# EAGLE schematic piezo-preamp-tickler_V2-RevG-Breakout (EAGLE 8.5.0)

## Sheet 1 of 2
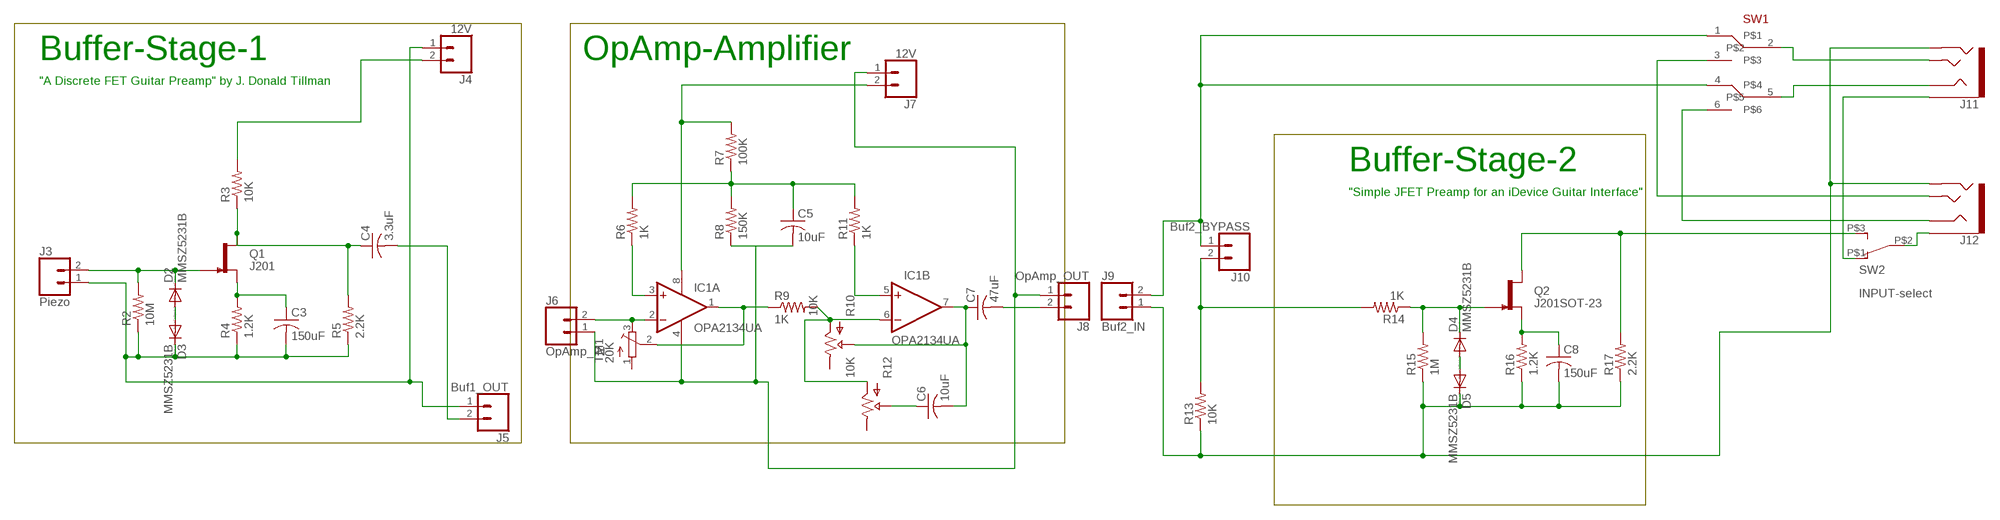
[diagram p0: schematic, sheet 1]

### Parts
C3  150uF  C-US  [CT7343]
C4  3.3uF  C-US  [CT7343]
C5  10uF  C-USC0805K  [C0805K]
C6  10uF  C-USC0805K  [C0805K]
C7  47uF  C-US  [CT7343]
C8  150uF  C-US  [CT7343]
D2  MMSZ5231B  DIODE-SOD123  [SOD123]
D3  MMSZ5231B  DIODE-SOD123  [SOD123]
D4  MMSZ5231B  DIODE-SOD123  [SOD123]
D5  MMSZ5231B  DIODE-SOD123  [SOD123]
IC1  OPA2134UA  [SO08]
J3  Piezo  CONN_02  [1X02]
J4  12V  CONN_02  [1X02]
J5  Buf1_OUT  CONN_02  [1X02]
J6  OpAmp_IN  CONN_02  [1X02]
J7  12V  CONN_02  [1X02]
J8  OpAmp_OUT  CONN_02  [1X02]
J9  Buf2_IN  CONN_02  [1X02]
J10  Buf2_BYPASS  CONN_02  [1X02]
J11  AUDIO-JACK3LGPADS  [AUDIO-JACK-TRRS-SMD]
J12  AUDIO-JACK3LGPADS  [AUDIO-JACK-TRRS-SMD]
Q1  J201  J201SOT-23  [SOT23-3]
Q2  J201SOT-23  [SOT23-3]
R2  10M  R-US_R0805  [R0805]
R3  10K  R-US_R0805  [R0805]
R4  1.2K  R-US_R0805  [R0805]
R5  2.2K  R-US_R0805  [R0805]
R6  1K  R-US_R0805  [R0805]
R7  100K  R-US_R0805  [R0805]
R8  150K  R-US_R0805  [R0805]
R9  1K  R-US_R0805  [R0805]
R10  10K  POTTHUMBPOT14  [THUMBPOT14]
R11  1K  R-US_R0805  [R0805]
R12  10K  POTTHUMBPOT14  [THUMBPOT14]
R13  10K  R-US_R0805  [R0805]
R14  1K  R-US_R0805  [R0805]
R15  1M  R-US_R0805  [R0805]
R16  1.2K  R-US_R0805  [R0805]
R17  2.2K  R-US_R0805  [R0805]
SW1  SWITCH_DPDT  [SWITCH_DPDT_CL-SB-22B]
SW2  INPUT-select  SWITCH_SPDTCL-SB-12B  [SWITCH_SPDT_CL-SB-12B]
TM1  20K  TRIMPOTTC33X  [TC33X]

### Nets
N$1: D4.A D5.A
N$2: D2.C J3.2 Q1.3(G) R2.2
N$3: C8.+ Q2.2(S) R16.2
N$5: IC1.5(B:+IN) R11.1
N$6: C6.2 C7.+ IC1.7(B:OUT) R10.P$2(WIPER)
N$7: IC1.6(B:-IN) R9.2 R10.P$1(IN) R12.P$1(IN)
N$8: D2.A D3.A
N$9: C4.+ Q1.1(D) R3.1 R5.2
N$10: D4.C Q2.3(G) R14.1 R15.2
N$11: J9.2 J10.1 SW1.1 SW1.4
N$12: J11.EARTH SW2.P$1
N$13: J11.TIP SW1.2
N$14: C3.+ Q1.2(S) R4.2
N$15: J11.RING1 SW1.5
N$17: J12.EARTH SW2.P$2
N$19: IC1.2(A:-IN) J6.2 TM1.3(E)
N$20: C3.- D3.C J3.1 J4.1 J5.1 R2.1 R4.1 R5.1
N$22: IC1.3(A:+IN) R6.1
N$23: C5.1 R6.2 R7.1 R8.2 R11.2
N$24: IC1.1(A:OUT) R9.1 TM1.2(S)
N$25: J4.2 R3.2
N$26: J12.RING1 SW1.6
N$27: J12.TIP SW1.3
N$28: C4.- J5.2
N$31: C6.1 R12.P$2(WIPER)
N$36: C7.- J8.2
N$42: IC1.8(A:V+) J7.2 R7.2
N$44: C5.2 IC1.4(A:V-) J6.1 J7.1 J8.1 R8.1
N$45: C8.- D5.C J9.1 J11.RING2 J12.RING2 R13.1 R15.1 R16.1 R17.1
N$46: J10.2 R13.2 R14.2
SELECT: Q2.1(D) R17.2 SW2.P$3
Unconnected: R10.P$3(OUT) R12.P$3(OUT) TM1.1(A)

### Notes on the sheet
- Buffer-Stage-1 | OpAmp-Amplifier
- "A Discrete FET Guitar Preamp" by J. Donald Tillman
- Buffer-Stage-2
- "Simple JFET Preamp for an iDevice Guitar Interface"

## Sheet 2 of 2
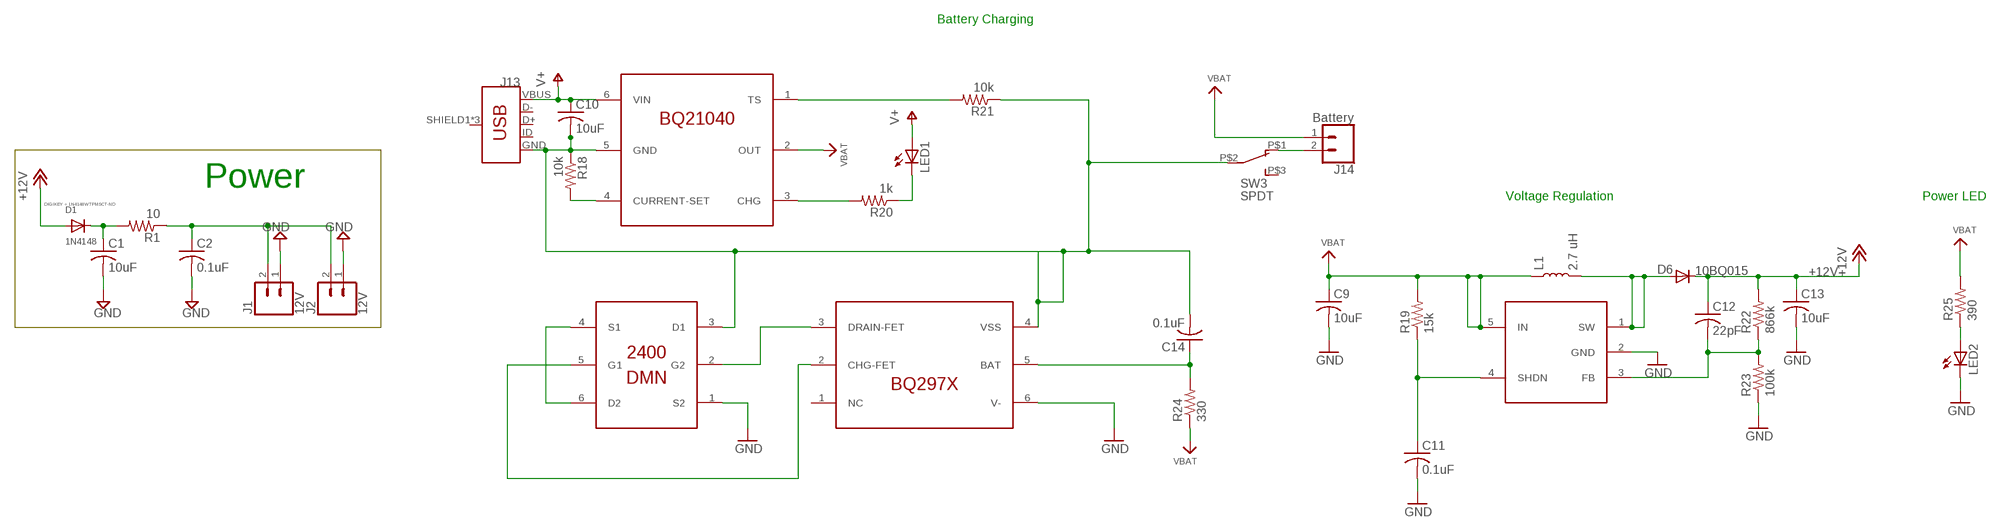
[diagram p1: schematic, sheet 2]

### Parts
C1  10uF  C-USC0805K  [C0805K]
C2  0.1uF  C-USC0805K  [C0805K]
C9  10uF  C-USC0805K  [C0805K]
C10  10uF  C-USC0805K  [C0805K]
C11  0.1uF  C-USC0805K  [C0805K]
C12  22pF  C-USC0805K  [C0805K]
C13  10uF  C-USC0805K  [C0805K]
C14  0.1uF  C-USC0805K  [C0805K]
D1  1N4148  DIODESOD-123  [SOD-123]
D6  10BQ015  DIODESMA  [SMA-DIODE]
J1  12V  CONN_02  [1X02]
J2  12V  CONN_02  [1X02]
J13  USB_MICRO-BREDUCED_PASTE  [USB-B-MICRO-SMD_RED_PASTE]
J14  Battery  CONN_02LOCK  [1X02_LOCK]
L1  2.7 uH  INDUCTOR-CR54-3.3UH  [CR54]
LED1  LED3MM  [LED3MM]
LED2  LED3MM  [LED3MM]
Q3  DMN2400  DUAL-NFET-DMN2400  [SOT-563]
Q4  BQ21040  BQ21040-LIPO-CHARGER  [SOT23-6]
Q5  SC4503  [SOT23-5]
Q6  BQ297X  BQ297X-BATTERY-MANAGER  [WSON-6]
R1  10  R-US_R0805  [R0805]
R18  10k  R-US_R0805  [R0805]
R19  15k  R-US_R0805  [R0805]
R20  1k  R-US_R0805  [R0805]
R21  10k  R-US_R0805  [R0805]
R22  866k  R-US_R0805  [R0805]
R23  100k  R-US_R0805  [R0805]
R24  330  R-US_R0805  [R0805]
R25  390  R-US_R0805  [R0805]
SW3  SPDT  SWITCH_SPDTCL-SB-12B  [SWITCH_SPDT_CL-SB-12B]

### Nets
+12V: C12.1 C13.1 D1.A D6.C R22.2
GND: C1.2 C2.2 C9.2 C11.2 C13.2 J1.1 J2.1 LED2.K(C) Q3.1(S2) Q5.2(GND) Q6.6(V-) R23.1
GND1: C10.2 C14.2 J13.GND Q3.3(D1) Q4.5(GND) Q6.4(VSS) R18.1 R21.1 SW3.P$2
N$16: C1.1 D1.C R1.2
N$18: LED2.A R25.1
N$21: J14.2 SW3.P$1
N$29: C11.1 Q5.4(SHDN) R19.1
N$30: C12.2 Q5.3(FB) R22.1 R23.2
N$32: D6.A L1.P$2 Q5.1(SW)
N$33: Q4.3(CHG) R20.2
N$34: C14.1 Q6.5(BAT) R24.2
N$35: Q4.1(TS) R21.2
N$37: Q3.4(S1) Q3.6(D2)
N$38: Q4.4(CURRENT-SET) R18.2
N$39: Q3.5(G1) Q6.2(CHG-FET)
N$40: LED1.K(C) R20.1
N$41: Q3.2(G2) Q6.3(DRAIN-FET)
N$43: C2.1 J1.2 J2.2 R1.1
V+: C10.1 J13.VBUS LED1.A Q4.6(VIN)
VBAT: C9.1 J14.1 L1.P$1 Q4.2(OUT) Q5.5(IN) R19.2 R24.1 R25.2
Unconnected: J13.D+ J13.D- J13.ID J13.SHIELD1(SHIELD) J13.SHIELD2(SHIELD) J13.SHIELD3(SHIELD) Q6.1(NC) SW3.P$3

### Notes on the sheet
- Battery Charging
- Power
- Voltage Regulation | Power LED

## Library data of the parts
C1-C14 = adafruit:C-US: CAPACITOR, American symbol
D1 = adafruit:DIODE: Diode; DIGIKEY: 1N4148WTPMSCT-ND
D2-D5 = diode:DIODE-: DIODE
D6 = SparkFun:DIODE: Diode
IC1 = linear:OPA2*: Dual Operational Amplifier Low Power, Single-Supply, Rail-To-Rail Operational Amplifier Source: http://focus.ti.com/lit/ds/symlink/opa2345.pdf http://focus.ti.com .. opa241.pdf http://focus.ti.com/lit/ds/symlink/opa2134.pdf
J1-J10 J14 = SparkFun-Connectors:CONN_02: Multi connection point. Often used as Generic Header-pin footprint for 0.1 inch spaced/style header connections On any of the 0.1 inch spaced packages, you can populate with these: Break Away Headers - Straight <https://www.sparkfun.com/products/116> (PRT-00116) Break Away Male Headers - Right Angle <https://www.sparkfun.com/products/553> (PRT-00553) Female Headers <https://www.sparkfun.com/products/115> (PRT-00115) Break Away Headers - Machine Pin <https://www.sparkfun.com/products/117> (PRT-00117) Break Away Female Headers - Swiss Machine Pin <https://www.sparkfun.com/products/743> (PRT-00743) For SCREWTERMINALS and SPRING TERMINALS visit here: Screw Terimnals on SparkFun.com <https://www.sparkfun.com/search/results?term=Screw+Terminals> (5mm/3.5mm/2.54mm spacing) This device is also useful as a general connection point to wire up your design to another part of your project. Our various solder wires solder well into these plated through hole pads. Hook-Up Wire - Assortment (Stranded, 22 AWG) <https://www.sparkfun.com/products/11375> (PRT-11375) Hook-Up Wire - Assortment (Solid Core, 22 AWG) <https://www.sparkfun.com/products/11367> (PRT-11367) View the entire wire category on our website here <https://www.sparkfun.com/categories/141> Special notes: Molex polarized connector foot print use with: PRT-08233 with associated crimp pins and housings. 2.54_SCREWTERM for use with PRT-10571. 3.5mm Screw Terminal footprints for PRT-08084 5mm Screw Terminal footprints for use with PRT-08432
J11 J12 = Daniel:AUDIO-JACK3: Audio jack - 3.5mm TRRS variety - two rings.
J13 = SparkFun-Connectors:USB_MICRO-B: USB Type Micro-B Connector Male/female and PTH/SMT variants SparkFun Products: SparkFun microB USB Breakout <https://www.sparkfun.com/products/12035> SparkFun USB microB Plug Breakout <https://www.sparkfun.com/products/10031> SparkFun ESP8266 Thing <https://www.sparkfun.com/products/13231>; PROD_ID: CONN-11752
L1 = SparkFun-Coils:INDUCTOR: Inductors Resist changes in electrical current. Basically a coil of wire. SparkFun Products: SparkFun Load Cell Amplifier - HX711 <https://www.sparkfun.com/products/13879> IOIO-OTG - V2.2 <https://www.sparkfun.com/products/13613>; PROD_ID: NDUC-11157; VALUE: 3.3µH/±30%/3.4A
LED1 LED2 = led:LED: LED OSRAM: - CHIPLED LG R971, LG N971, LY N971, LG Q971, LY Q971, LO R971, LY R971 LH N974, LH R974 LS Q976, LO Q976, LY Q976 LO Q996 - Hyper CHIPLED LW Q18S LB Q993, LB Q99A, LB R99A - SideLED LS A670, LO A670, LY A670, LG A670, LP A670 LB A673, LV A673, LT A673, LW A673 LH A674 LY A675 LS A676, LA A676, LO A676, LY A676, LW A676 LS A679, LY A679, LG A679 - Hyper Micro SIDELED® LS Y876, LA Y876, LO Y876, LY Y876 LT Y87S - SmartLED LW L88C, LW L88S LB L89C, LB L89S, LG L890 LS L89K, LO L89K, LY L89K LS L896, LA L896, LO L896, LY L896 - TOPLED LS T670, LO T670, LY T670, LG T670, LP T670 LSG T670, LSP T670, LSY T670, LOP T670, LYG T670 LG T671, LOG T671, LSG T671 LB T673, LV T673, LT T673, LW T673 LH T674 LS T676, LA T676, LO T676, LY T676, LB T676, LH T676, LSB T676, LW T676 LB T67C, LV T67C, LT T67C, LS T67K, LO T67K, LY T67K, LW E67C LS E67B, LA E67B, LO E67B, LY E67B, LB E67C, LV E67C, LT E67C LW T67C LS T679, LY T679, LG T679 LS T770, LO T770, LY T770, LG T770, LP T770 LB T773, LV T773, LT T773, LW T773 LH T774 LS E675, LA E675, LY E675, LS T675 LS T776, LA T776, LO T776, LY T776, LB T776 LHGB T686 LT T68C, LB T68C - Hyper Mini TOPLED® LB M676 - Mini TOPLED Santana® LG M470 LS M47K, LO M47K, LY M47K Source: http://www.osram.convergy.de LUXEON: - LUMILED® LXK2-PW12-R00, LXK2-PW12-S00, LXK2-PW14-U00, LXK2-PW14-V00 LXK2-PM12-R00, LXK2-PM12-S00, LXK2-PM14-U00 LXK2-PE12-Q00, LXK2-PE12-R00, LXK2-PE12-S00, LXK2-PE14-T00, LXK2-PE14-U00 LXK2-PB12-K00, LXK2-PB12-L00, LXK2-PB12-M00, LXK2-PB14-N00, LXK2-PB14-P00, LXK2-PB14-Q00 LXK2-PR12-L00, LXK2-PR12-M00, LXK2-PR14-Q00, LXK2-PR14-R00 LXK2-PD12-Q00, LXK2-PD12-R00, LXK2-PD12-S00 LXK2-PH12-R00, LXK2-PH12-S00 LXK2-PL12-P00, LXK2-PL12-Q00, LXK2-PL12-R00 Source: www.luxeon.com KINGBRIGHT: KA-3528ASYC Source: www.kingbright.com
Q1 Q2 = CMU-ArtFab:J201: N-channel JFET
Q3 = CMU-ArtFab:DUAL-NFET-DMN2400
Q4 = CMU-ArtFab:BQ21040-LIPO-CHARGER
Q5 = CMU-ArtFab:SC4503
Q6 = CMU-ArtFab:BQ297X-BATTERY-MANAGER
R1-R9 R11 R13-R25 = CMU-ArtFab:R-US_: RESISTOR, American symbol
R10 R12 = CMU-ArtFab:POT: http://www.taydaelectronics.com/10k-ohm-linear-taper-potentiometer-round-shaft-pcb-9mm.html http://www.taydaelectronics.com/datasheets/A-1847.pdf
SW1 = CMU-ArtFab:SWITCH_DPDT
SW2 SW3 = CMU-ArtFab:SWITCH_SPDT
TM1 = adafruit:TRIMPOT: SMT trimmer potentiometer part number TC33X http://www.ladyada.net/library/eagle